# EAGLE design UsbAsp_IR-Gross-24 (EAGLE 6.3)
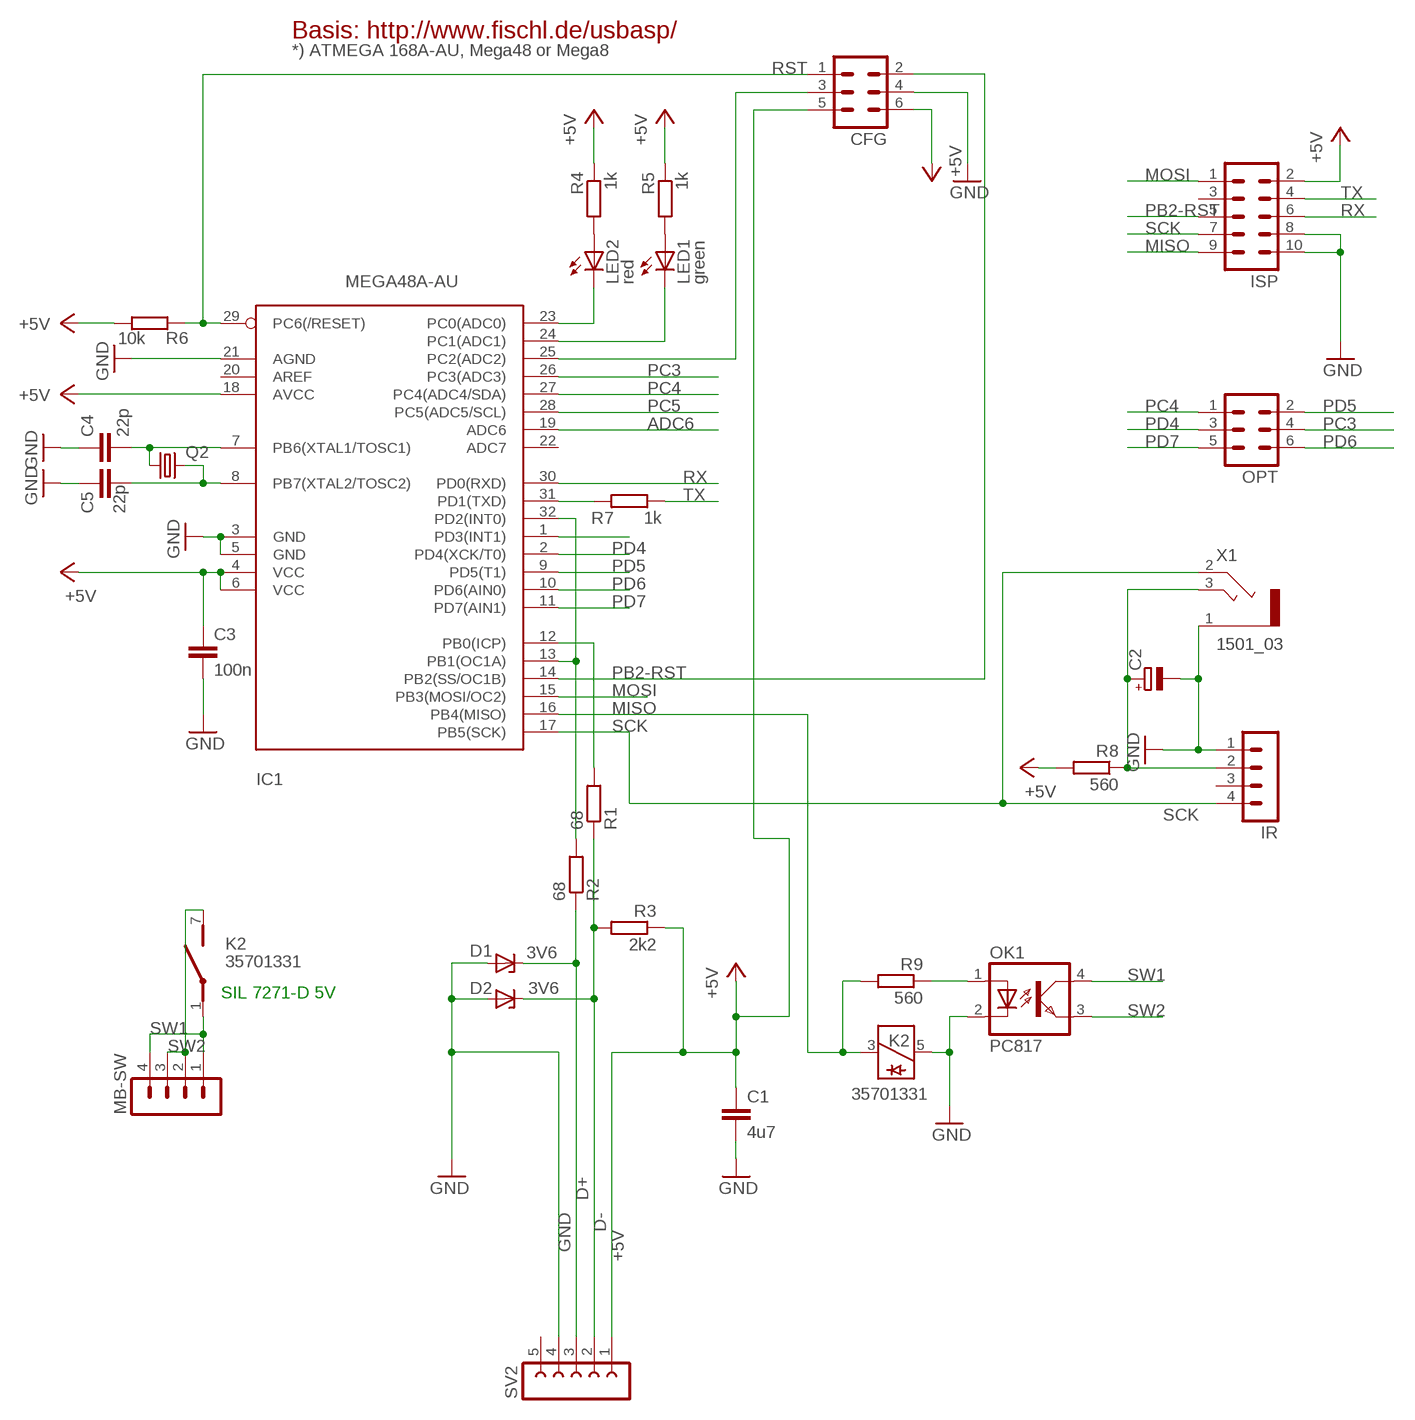
[diagram p0: schematic, sheet 1]

## Parts
C1  4u7  C-EUC0805  [C0805]
C2  CPOL-EU085CS-1AR  [085CS_1AR]
C3  100n  C-EUC0805  [C0805]
C4  22p  C-EUC0805  [C0805]
C5  22p  C-EUC0805  [C0805]
CFG  MA03-2  [MA03-2]
D1  3V6  ZENER-DIODESOD80C  [SOD80C]
D2  3V6  ZENER-DIODESOD80C  [SOD80C]
IC1  MEGA48A-AU  MEGA8-AI  [TQFP32-08]
IR  MA04-1  [MA04-1]
ISP  MA05-2  [MA05-2]
K2  35701331  [REED]
LED1  green  LEDCHIPLED_1206  [CHIPLED_1206]
LED2  red  LEDCHIPLED_1206  [CHIPLED_1206]
MB-SW  MA04-1  [MA04-1]
OK1  PC817  [DIL04]
OPT  MA03-2  [MA03-2]
Q2  CRYSTALHC49UP  [HC49UP]
R1  68  R-EU_M0805  [M0805]
R2  68  R-EU_M0805  [M0805]
R3  2k2  R-EU_M0805  [M0805]
R4  1k  R-EU_M0805  [M0805]
R5  1k  R-EU_M0805  [M0805]
R6  10k  R-EU_M0805  [M0805]
R7  1k  R-EU_M0805  [M0805]
R8  560  R-EU_M0805  [M0805]
R9  560  R-EU_M0805  [M0805]
SV2  FE05W  [FE05W]
X1  1501_03  [1501_03]

## Nets
+5V: C1.1 C3.1 CFG.5 CFG.6 IC1.4(VCC) IC1.6(VCC) IC1.18(AVCC) ISP.2 R3.1 R4.1 R5.1 R6.1 R8.2 SV2.1
ADC6: IC1.19(ADC6)
D+: D1.C R2.1 SV2.3
D-: D2.C R1.1 R3.2 SV2.2
GND: C1.2 C2.- C3.2 C4.1 C5.1 CFG.4 D1.A D2.A IC1.3(GND) IC1.5(GND) IC1.21(AGND) IR.1 ISP.8 ISP.10 K2.5 OK1.2(C) SV2.4 X1.1
MISO: IC1.16(PB4(MISO)) ISP.9 K2.3 R9.2
MOSI: IC1.15(PB3(MOSI/OC2)) ISP.1
N$1: OK1.1(A) R9.1
N$2: CFG.3 IC1.25(PC2(ADC2))
N$4: C2.+ IR.2 R8.1 X1.3
N$6: IC1.31(PD1(TXD)) R7.2
N$7: IC1.13(PB1(OC1A)) IC1.32(PD2(INT0)) R2.2
N$13: LED2.A R4.2
N$14: IC1.23(PC0(ADC0)) LED2.C
N$15: IC1.24(PC1(ADC1)) LED1.C
N$16: IC1.12(PB0(ICP)) R1.2
N$21: IC1.1(PD3(INT1))
N$22: C4.2 IC1.7(PB6(XTAL1/TOSC1)) Q2.1
N$23: C5.2 IC1.8(PB7(XTAL2/TOSC2)) Q2.2
N$25: LED1.A R5.2
PB2-RST: CFG.2 IC1.14(PB2(SS/OC1B)) ISP.5
PC3: IC1.26(PC3(ADC3)) OPT.4
PC4: IC1.27(PC4(ADC4/SDA)) OPT.1
PC5: IC1.28(PC5(ADC5/SCL))
PD4: IC1.2(PD4(XCK/T0)) OPT.3
PD5: IC1.9(PD5(T1)) OPT.2
PD6: IC1.10(PD6(AIN0)) OPT.6
PD7: IC1.11(PD7(AIN1)) OPT.5
RST: CFG.1 IC1.29(PC6(/RESET)) R6.2
RX: IC1.30(PD0(RXD)) ISP.6
SCK: IC1.17(PB5(SCK)) IR.4 ISP.7 X1.2
SW1: K2.1(2:P) MB-SW.1 MB-SW.4 OK1.4(COL)
SW2: K2.7(2:S) MB-SW.2 MB-SW.3 OK1.3(EMIT)
TX: ISP.4 R7.1
Unconnected: IC1.20(AREF) IC1.22(ADC7) IR.3 ISP.3 SV2.5

## Notes on the sheet
- Basis: http://www.fischl.de/usbasp/
- *) ATMEGA 168A-AU, Mega48 or Mega8
- SIL 7271-D 5V

## Library data of the parts
C1 C3-C5 = rcl:C-EU: CAPACITOR, European symbol
C2 = rcl:CPOL-EU: POLARIZED CAPACITOR, European symbol
CFG OPT = con-lstb:MA03-2: PIN HEADER; OC_FARNELL: unknown; OC_NEWARK: unknown
D1 D2 = diode:ZENER-DIODE: Z-Diode
IC1 = atmel:MEGA8: MICROCONTROLLER 8 Kbytes FLASH, 1 kbytes SRAM, 512 bytes EEPROM, USART, 6-channel 10 bit ADC, 2-channel 8 bit ADC Pin compatible with Atmega48, ATMega88, ATMega168 Source: avr.lbr
IR MB-SW = con-lstb:MA04-1: PIN HEADER; OC_FARNELL: unknown; OC_NEWARK: unknown
ISP = con-lstb:MA05-2: PIN HEADER; OC_FARNELL: unknown; OC_NEWARK: unknown
K2 = relay:35701331: RELAY reed, 1 x norm. open with polarity; OC_FARNELL: unknown; OC_NEWARK: unknown
LED1 LED2 = led:LED: LED OSRAM: - CHIPLED LG R971, LG N971, LY N971, LG Q971, LY Q971, LO R971, LY R971 LH N974, LH R974 LS Q976, LO Q976, LY Q976 LO Q996 - Hyper CHIPLED LW Q18S LB Q993, LB Q99A, LB R99A - SideLED LS A670, LO A670, LY A670, LG A670, LP A670 LB A673, LV A673, LT A673, LW A673 LH A674 LY A675 LS A676, LA A676, LO A676, LY A676, LW A676 LS A679, LY A679, LG A679 - Hyper Micro SIDELED® LS Y876, LA Y876, LO Y876, LY Y876 LT Y87S - SmartLED LW L88C, LW L88S LB L89C, LB L89S, LG L890 LS L89K, LO L89K, LY L89K LS L896, LA L896, LO L896, LY L896 - TOPLED LS T670, LO T670, LY T670, LG T670, LP T670 LSG T670, LSP T670, LSY T670, LOP T670, LYG T670 LG T671, LOG T671, LSG T671 LB T673, LV T673, LT T673, LW T673 LH T674 LS T676, LA T676, LO T676, LY T676, LB T676, LH T676, LSB T676, LW T676 LB T67C, LV T67C, LT T67C, LS T67K, LO T67K, LY T67K, LW E67C LS E67B, LA E67B, LO E67B, LY E67B, LB E67C, LV E67C, LT E67C LW T67C LS T679, LY T679, LG T679 LS T770, LO T770, LY T770, LG T770, LP T770 LB T773, LV T773, LT T773, LW T773 LH T774 LS E675, LA E675, LY E675, LS T675 LS T776, LA T776, LO T776, LY T776, LB T776 LHGB T686 LT T68C, LB T68C - Hyper Mini TOPLED® LB M676 - Mini TOPLED Santana® LG M470 LS M47K, LO M47K, LY M47K Source: http://www.osram.convergy.de - LUMILED® LXK2-PW12-R00, LXK2-PW12-S00, LXK2-PW14-U00, LXK2-PW14-V00 LXK2-PM12-R00, LXK2-PM12-S00, LXK2-PM14-U00 LXK2-PE12-Q00, LXK2-PE12-R00, LXK2-PE12-S00, LXK2-PE14-T00, LXK2-PE14-U00 LXK2-PB12-K00, LXK2-PB12-L00, LXK2-PB12-M00, LXK2-PB14-N00, LXK2-PB14-P00, LXK2-PB14-Q00 LXK2-PR12-L00, LXK2-PR12-M00, LXK2-PR14-Q00, LXK2-PR14-R00 LXK2-PD12-Q00, LXK2-PD12-R00, LXK2-PD12-S00 LXK2-PH12-R00, LXK2-PH12-S00 LXK2-PL12-P00, LXK2-PL12-Q00, LXK2-PL12-R00 Source: www.luxeon.com
OK1 = optocoupler:PC817: SHARP OPTO COUPLER; MPN: PC817X4J000F; OC_FARNELL: 9707727; OC_NEWARK: 97K7059
Q2 = crystal:CRYSTAL: CRYSTAL
R1-R9 = rcl:R-EU_: RESISTOR, European symbol
SV2 = con-lsta:FE05W: FEMALE HEADER; OC_FARNELL: unknown; OC_NEWARK: unknown
X1 = con-lumberg:1501_03: Klinkensteckverbinder nach JISC 6560, 2,5 mm Jack connectors according to JISC 6560, 2.5 mm Source: http://www.lumberg.com/Produkte/PDFs/1501_03.pdf; OC_FARNELL: 1200127; OC_NEWARK: unknown

## Board
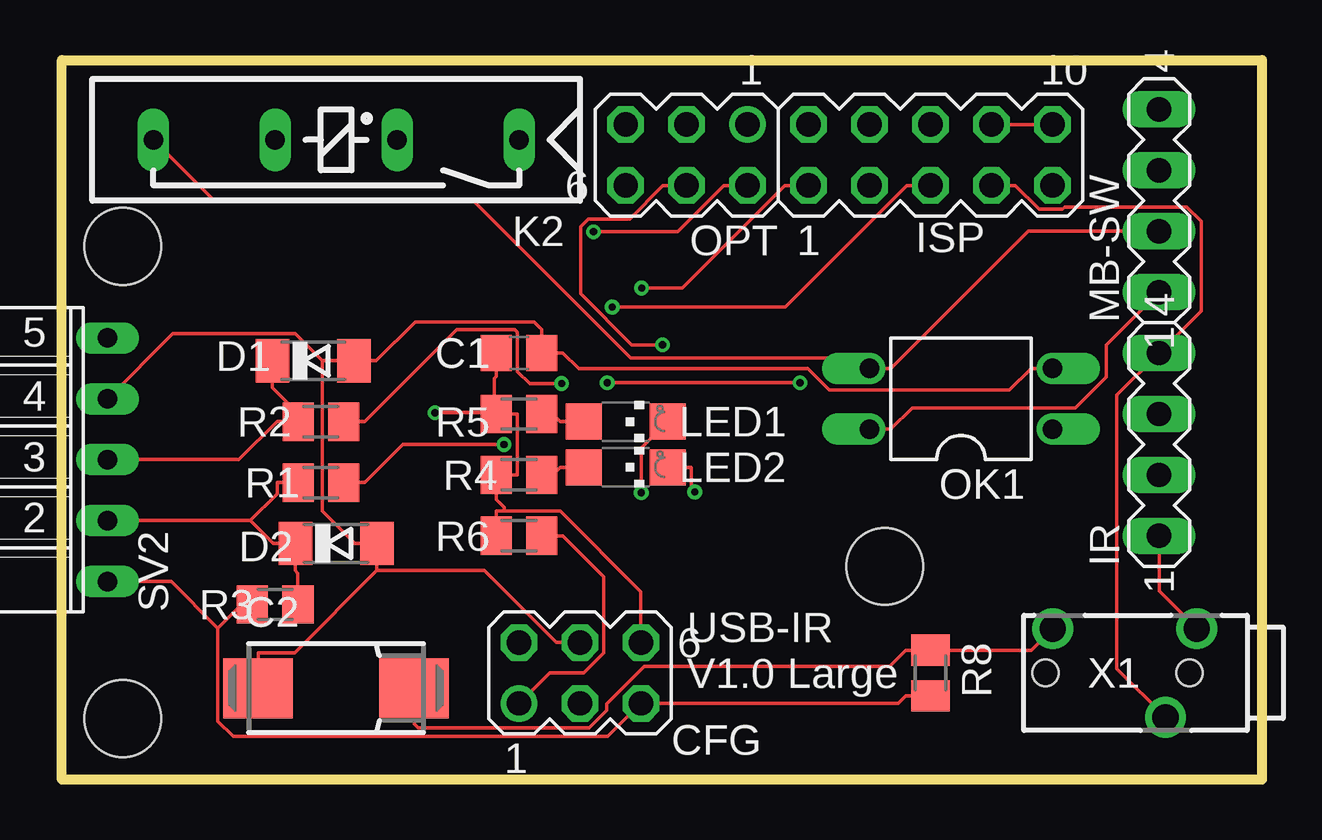
[diagram p1: board, top side]
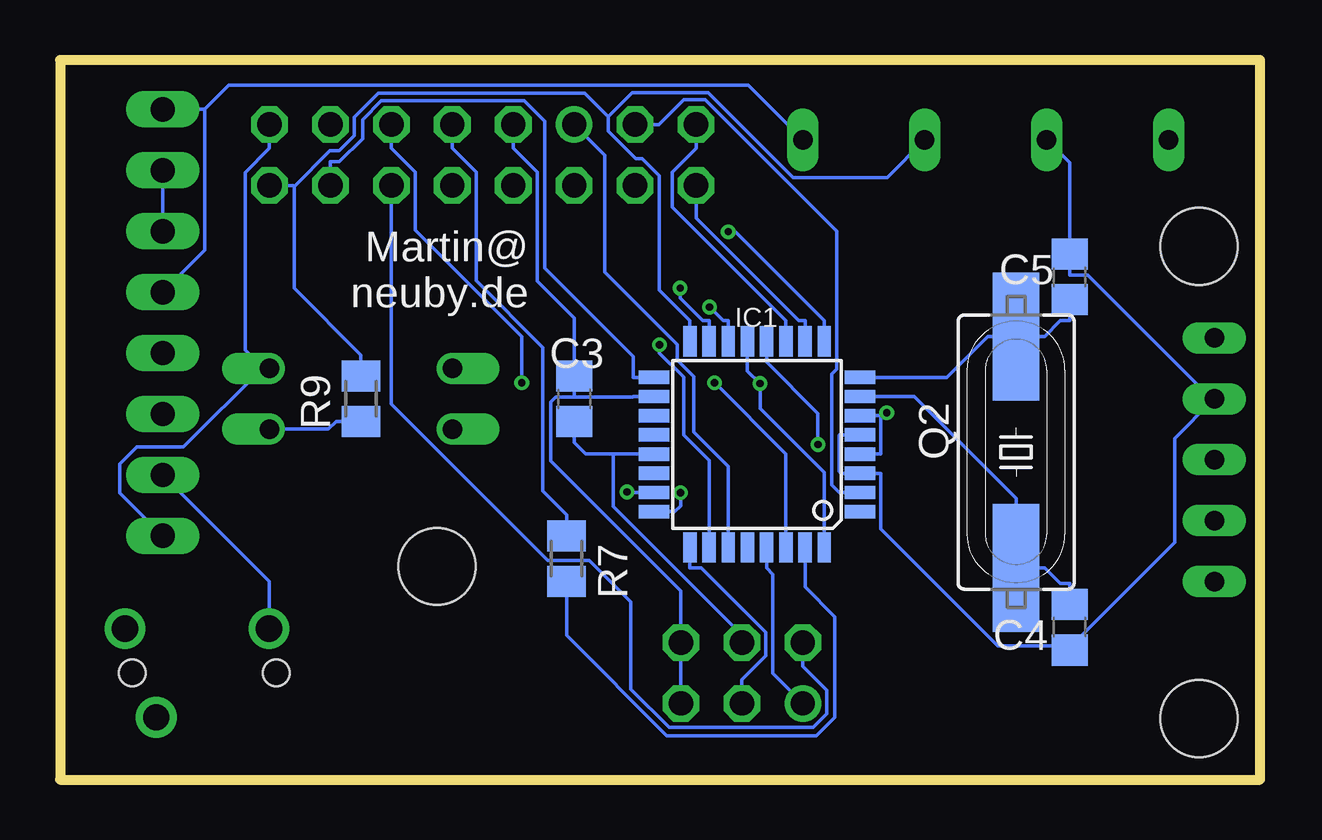
[diagram p2: board, bottom side, seen from below]

Size 50 x 30 mm. Coordinates in mm from the lower left corner, seen from the top.
Outline: 0,0 0,30 50,30 50,0 0,0
Copper layers (1*16): Top 0.035mm / dielectric 1.5mm / Bottom 0.035mm
Design rules "Fusion_eagle_rule_v1.1": minimum track width 6mil, minimum drill 12mil, track to track 6mil, track to pad 6mil, pad to pad 6mil, via to via 6mil, smd to smd 0mil, copper to edge 10mil, drill to drill 10mil, minimum pad ring 10mil, minimum via ring 6mil, stop-mask expansion 2mil, vias tented up to drill 100mil, thermal gap 10mil
Holes 3.2 mm at 2.54,2.54 2.54,22.23 34.29,8.89

### Footprints (pad centres in the part's own frame; a part is rotated, then mirrored left to right if it is on the bottom)
C0805 = smd 1.3 x 1.5: 1 -0.95,0; 2 0.95,0
085CS_1AR = smd 2.9 x 2.5: + 3.25,0; - -3.25,0
MA03-2 = drill 1.016: 1 -2.54,-1.27 | drill 1.016 octagon: 2 -2.54,1.27; 3 0,-1.27; 4 0,1.27; 5 2.54,-1.27; 6 2.54,1.27
SOD80C = smd 1.4 x 1.8: A 1.7,0; C -1.7,0
TQFP32-08 = smd 1.27 x 0.559: 1 -4.293,2.8; 2 -4.293,2; 3 -4.293,1.2; 4 -4.293,0.4; 5 -4.293,-0.4; 6 -4.293,-1.2; 7 -4.293,-2; 8 -4.293,-2.8; 17 4.293,-2.8; 18 4.293,-2; 19 4.293,-1.2; 20 4.293,-0.4; 21 4.293,0.4; 22 4.293,1.2; 23 4.293,2; 24 4.293,2.8 | smd 0.559 x 1.27: 9 -2.8,-4.293; 10 -2,-4.293; 11 -1.2,-4.293; 12 -0.4,-4.293; 13 0.4,-4.293; 14 1.2,-4.293; 15 2,-4.293; 16 2.8,-4.293; 25 2.8,4.293; 26 2,4.293; 27 1.2,4.293; 28 0.4,4.293; 29 -0.4,4.293; 30 -1.2,4.293; 31 -2,4.293; 32 -2.8,4.293
MA04-1 = drill 1.016 long: 1 -3.81,0; 2 -1.27,0; 3 1.27,0; 4 3.81,0
MA05-2 = drill 1.016 octagon: 1 -5.08,-1.27; 2 -5.08,1.27; 3 -2.54,-1.27; 4 -2.54,1.27; 5 0,-1.27; 6 0,1.27; 7 2.54,-1.27; 8 2.54,1.27; 9 5.08,-1.27; 10 5.08,1.27
REED = drill 0.813 long: 1 -17.78,2.54; 3 -12.7,2.54; 5 -7.62,2.54; 7 -2.54,2.54
CHIPLED_1206 = smd 1.5 x 1.5: A 0,-1.75; C 0,1.75
DIL04 = drill 0.813 offset: 1 -1.27,-3.81; 2 1.27,-3.81; 3 1.27,3.81; 4 -1.27,3.81
HC49UP = smd 5.334 x 1.93: 1 -4.826,0; 2 4.826,0
M0805 = smd 1.3 x 1.6: 1 -0.95,0; 2 0.95,0
FE05W = drill 0.813 long: 1 -5.08,0; 2 -2.54,0; 3 0,0; 4 2.54,0; 5 5.08,0
1501_03 = drill 1.1 pad 1.7: 1 -1.85,0.3; 2 1.85,-1; 3 -1.85,-5.7 | hole 1.1: 0,0; 0,-6

### Placement (x,y rotation side)
C1  19.05,17.78 0 top
C2  11.43,3.81 0 top
C3  28.57,15.88 270 bottom
C4  7.94,6.35 90 bottom
C5  7.94,20.95 270 bottom
CFG  21.59,4.45 0 top
D1  10.48,17.46 0 top
D2  11.43,9.84 0 top
IC1  20.95,13.97 180 bottom
IR  45.72,13.97 90 top
ISP  36.2,26.04 0 top
K2  1.27,29.21 180 top
LED1  23.5,14.92 270 top
LED2  23.5,13.02 270 top
MB-SW  45.72,24.13 90 top
OK1  37.47,15.88 90 top
OPT  26.04,26.04 180 top
Q2  10.16,13.65 90 bottom
R1  10.79,12.38 0 top
R2  10.79,14.92 0 top
R3  8.89,7.3 0 top
R4  19.05,12.7 0 top
R5  19.05,15.24 0 top
R6  19.05,10.16 0 top
R7  28.89,9.21 270 bottom
R8  36.2,4.45 270 top
R9  37.47,15.88 90 bottom
SV2  1.91,13.34 90 top
X1  46.99,4.45 270 top

### Tracks (layer width: path | path; a pad name or v marks a point on that pad's centre or on a via)
+5V  (via drill 0.3 pad 0.61)
  Top 0.152: 6.5,6.3 6.5,2.43 7.14,1.79 22.75,1.79 CFG.5 34.85,3.17 35.17,3.5 R8.2 | 18.02,15.29 v15.55,15.29 | 18.02,15.29 18.02,16.72 18.1,16.8 C1.1 | 18.02,15.29 18.02,15.24 R5.1 18.98,15.24 18.98,12.7 R4.1 18.1,12.19 18.1,11.67 18.44,11.34 18.44,11.19 | 6.5,6.3 7.5,7.3 R3.1 | SV2.1 4.55,8.26 6.5,6.3 | R6.1 18.1,11.19 18.44,11.19 | 18.44,11.19 | CFG.6 24.13,7.82 20.76,11.19 18.44,11.19
  Bottom 0.152: 15.8,15.17 15.8,13.57 IC1.4 | v15.55,15.29 15.67,15.29 15.8,15.17 | IC1.6 15.8,15.17 | 28.57,15.95 29.34,15.95 29.55,15.74 29.55,13.29 24.13,7.86 24.13,6.71 CFG.6 CFG.5 | IC1.18 26.11,15.97 26.14,15.95 28.57,15.95 | 28.57,15.95 C3.1 28.57,19.23 30.12,20.78 30.12,25.32 31.11,26.31 ISP.2
D+
  Top 0.152: D1.C 8.78,16.33 9.41,15.71 9.41,14.92 | 9.41,14.92 8.97,14.92 7.38,13.34 SV2.3 | R2.1 9.41,14.92
D-
  Top 0.152: R1.1 8.97,12.38 8.97,11.91 7.85,10.79 | 7.85,10.79 8.8,9.84 D2.C 9.73,8.71 9.84,8.6 R3.2 | SV2.2 7.85,10.79
GND
  Top 0.152: OK1.2 40.39,17.14 39.48,16.24 31.97,16.24 31.08,17.13 21.53,17.13 20.88,17.78 C1.2 20,18.76 19.69,19.07 14.72,19.07 13.11,17.46 D1.A 11.71,17.46 11.25,17.46 10.86,17.46 | 10.86,17.46 9.73,18.59 4.62,18.59 SV2.4 | 10.86,17.46 10.86,11.19 12.2,9.84 D2.A 13.13,8.71 | CFG.4 20.6,5.71 17.6,8.71 13.13,8.71 | C2.- 8.18,5.29 9.71,5.29 13.13,8.71 | X1.1 45.72,7.87 IR.1 | ISP.10 ISP.8
  Bottom 0.152: 7.94,5.57 10.93,5.57 15.8,10.44 15.8,12.77 IC1.3 17.45,12.77 17.53,12.85 17.53,14.37 IC1.5 | 7.94,5.57 7.94,5.74 7.69,5.74 3.56,9.88 3.56,14.22 1.96,15.82 | C4.1 7.94,5.57 | CFG.4 21.59,6.04 26.94,11.39 26.94,13.57 | 26.94,13.57 28.1,13.57 28.57,14.05 C3.2 | IC1.21 26.94,13.57 | 1.96,15.82 SV2.4 | 1.96,15.82 7.17,21.03 7.94,21.03 C5.1 7.94,25.72 K2.5 | 41.56,17.16 42.29,17.9 42.29,25.3 41.27,26.31 ISP.10 | IR.1 47.51,11.95 47.51,13.15 46.79,13.86 44.86,13.86 41.56,17.16 | 41.56,17.16 41.29,17.16 OK1.2
MISO
  Bottom 0.152: 27.15,27.63 27.15,27.02 26.02,25.89 25.74,25.89 25.04,25.18 25.04,20.41 23.75,19.13 IC1.16 | K2.3 15.54,25.1 19.45,25.1 22.99,28.64 26.15,28.64 27.15,27.63 | 40.25,24.73 38.76,26.21 38.37,26.21 37.74,26.84 37.74,27.61 36.74,28.61 28.13,28.61 27.15,27.63 | 40.25,24.73 40.28,24.77 ISP.9 | 40.25,24.73 40.25,20.49 37.47,17.7 R9.2
MOSI  (via drill 0.3 pad 0.61)
  Top 0.152: ISP.1 30.12,24.77 25.85,20.49 v24.16,20.49
  Bottom 0.152: IC1.15 22.95,19.13 23.21,19.13 24.16,20.08 v24.16,20.49
N$1
  Bottom 0.152: R9.1 38.49,14.93 38.81,14.61 OK1.1
N$2
  Bottom 0.152: CFG.3 21.59,4.17 20.6,5.16 20.6,6.12 23.29,8.81 23.75,8.81 IC1.25
N$4
  Top 0.152: C2.+ 14.68,2.33 14.85,2.16 21.98,2.16 22.71,2.89 22.71,3.16 24.27,4.72 34.49,4.72 35.17,5.39 R8.1 40.39,5.39 X1.3
  Bottom 0.152: X1.3 41.29,8.27 IR.2
N$6
  Bottom 0.152: R7.2 28.89,6.01 24.71,1.83 18.48,1.83 17.72,2.59 17.72,6.79 18.95,8.03 IC1.31
N$7  (via drill 0.3 pad 0.61)
  Top 0.152: R2.2 12.62,14.92 16.46,18.76 18.87,18.76 18.98,18.65 18.98,17.02 19.49,16.51 v20.83,16.51
  Bottom 0.152: IC1.32 18.16,12.79 20.83,15.47 v20.83,16.51 21.36,17.04 IC1.13
N$13
  Top 0.152: LED2.A 20.77,13.02 20.45,12.7 R4.2
N$14  (via drill 0.3 pad 0.61)
  Top 0.152: v26.37,11.99 26.22,12.14 26.22,13.02 LED2.C
  Bottom 0.152: IC1.23 26.11,11.97 26.13,11.99 v26.37,11.99
N$15  (via drill 0.3 pad 0.61)
  Top 0.152: LED1.C 24.14,13.82 v24.14,11.96
  Bottom 0.152: v24.14,11.96 24.14,11.41 24.38,11.17 IC1.24
N$16  (via drill 0.3 pad 0.61)
  Top 0.152: R1.2 12.62,12.38 14.21,13.97 v18.42,13.97
  Bottom 0.152: IC1.12 20.55,17.4 18.42,15.26 v18.42,13.97
N$22
  Bottom 0.152: IC1.7 15.8,15.97 14.41,15.97 10.16,11.72 Q2.1 8.97,8.83 8.32,8.18 7.94,8.18 C4.2
N$23
  Bottom 0.152: C5.2 7.94,19.13 8.32,19.13 8.97,18.48 Q2.2 11.35,18.48 13.06,16.77 15.8,16.77 IC1.8
N$25
  Top 0.152: LED1.A 20.77,14.92 20.45,15.24 R5.2
PB2-RST  (via drill 0.3 pad 0.61)
  Top 0.152: ISP.5 35.2,24.77 30.14,19.7 v22.93,19.7
  Bottom 0.152: IC1.14 22.16,19.13 22.36,19.13 v22.93,19.7 | CFG.2 19.05,4.72 18.05,3.73 18.05,2.73 18.61,2.17 24.62,2.17 26.21,3.77 26.21,7.41 27.94,9.14 29.68,9.14 36.2,15.65 36.2,23.77 ISP.5
PC3  (via drill 0.3 pad 0.61)
  Top 0.152: v25.02,18.12 23.75,18.12 21.62,20.25 21.62,23.06 21.94,23.37 23.65,23.37 25.04,24.77 OPT.4
  Bottom 0.152: IC1.26 22.95,13.31 24.01,14.36 24.01,16.77 25.02,17.79 v25.02,18.12
PC4
  Bottom 0.152: OPT.1 27.3,26.04 27.3,21.16 24.28,18.13 24.28,17.48 23.59,16.79 23.59,14.49 22.16,13.06 IC1.27
PD4
  Bottom 0.152: IC1.2 17.53,11.97 17.84,12.28 17.84,16.9 17.64,17.11 17.64,22.86 23.12,28.33 24.02,28.33 25.04,27.3 OPT.3
PD5  (via drill 0.3 pad 0.61)
  Top 0.152: v22.16,22.84 25.66,22.84 27.58,24.77 OPT.2
  Bottom 0.152: v22.16,22.84 21.87,22.84 18.16,19.13 IC1.9 | v22.16,22.84
PD6
  Bottom 0.152: IC1.10 18.95,19.13 19.21,19.13 23.5,23.41 OPT.6
PD7
  Bottom 0.152: IC1.11 19.75,19.13 24.49,23.86 24.49,25.32 23.5,26.31 OPT.5
RST
  Top 0.152: R6.2 20.88,10.16 22.58,8.46 22.58,5.29 21.74,4.45 20.32,4.45 CFG.1
  Bottom 0.152: IC1.29 20.55,8.81 20.29,8.55 20.29,4.42 CFG.1
RX  (via drill 0.3 pad 0.61)
  Top 0.152: v30.76,16.54 v22.73,16.54
  Bottom 0.152: v22.73,16.54 19.75,13.57 IC1.30 | ISP.6 36.2,26.31 35.2,25.32 35.2,22.91 30.76,18.46 v30.76,16.54
SCK
  Top 0.152: ISP.7 39.73,24.77 40.72,23.77 41.69,23.77 41.78,23.87 46.88,23.87 47.47,23.27 47.47,19.53 IR.4 43.96,16.02 43.96,4.62 X1.2
  Bottom 0.152: ISP.7 38.73,25.76 38.36,25.76 37.39,26.73 37.39,27.51 36.61,28.3 30.66,28.3 29.8,27.44 29.8,21.32 26.11,17.63 26.11,16.77 IC1.17
SW1
  Top 0.152: OK1.4 34.54,14.61 35.43,15.49 42.22,15.49 43.51,16.79 43.51,18.11 MB-SW.1
  Bottom 0.152: 43.97,27.94 42.96,28.94 21.32,28.94 K2.1 | MB-SW.1 43.97,22.07 43.97,27.94 | MB-SW.4 43.97,27.94
SW2
  Top 0.152: K2.7 6.32,24.16 17.12,24.16 23.7,17.58 33.22,17.58 OK1.3 34.54,17.14 40.26,22.86 MB-SW.2
  Bottom 0.152: MB-SW.3 MB-SW.2
TX
  Bottom 0.152: ISP.4 33.66,26.31 32.66,25.32 32.66,20.8 29.89,18.02 29.89,12.03 28.89,11.04 R7.1

### Text on the board
tNames: USB-IR / V1.0 Large
bNames: Martin@ / neuby.de